# EAGLE design weather-cube_sensor_hdc1080_sht31d_ntc (EAGLE 7.7.0)
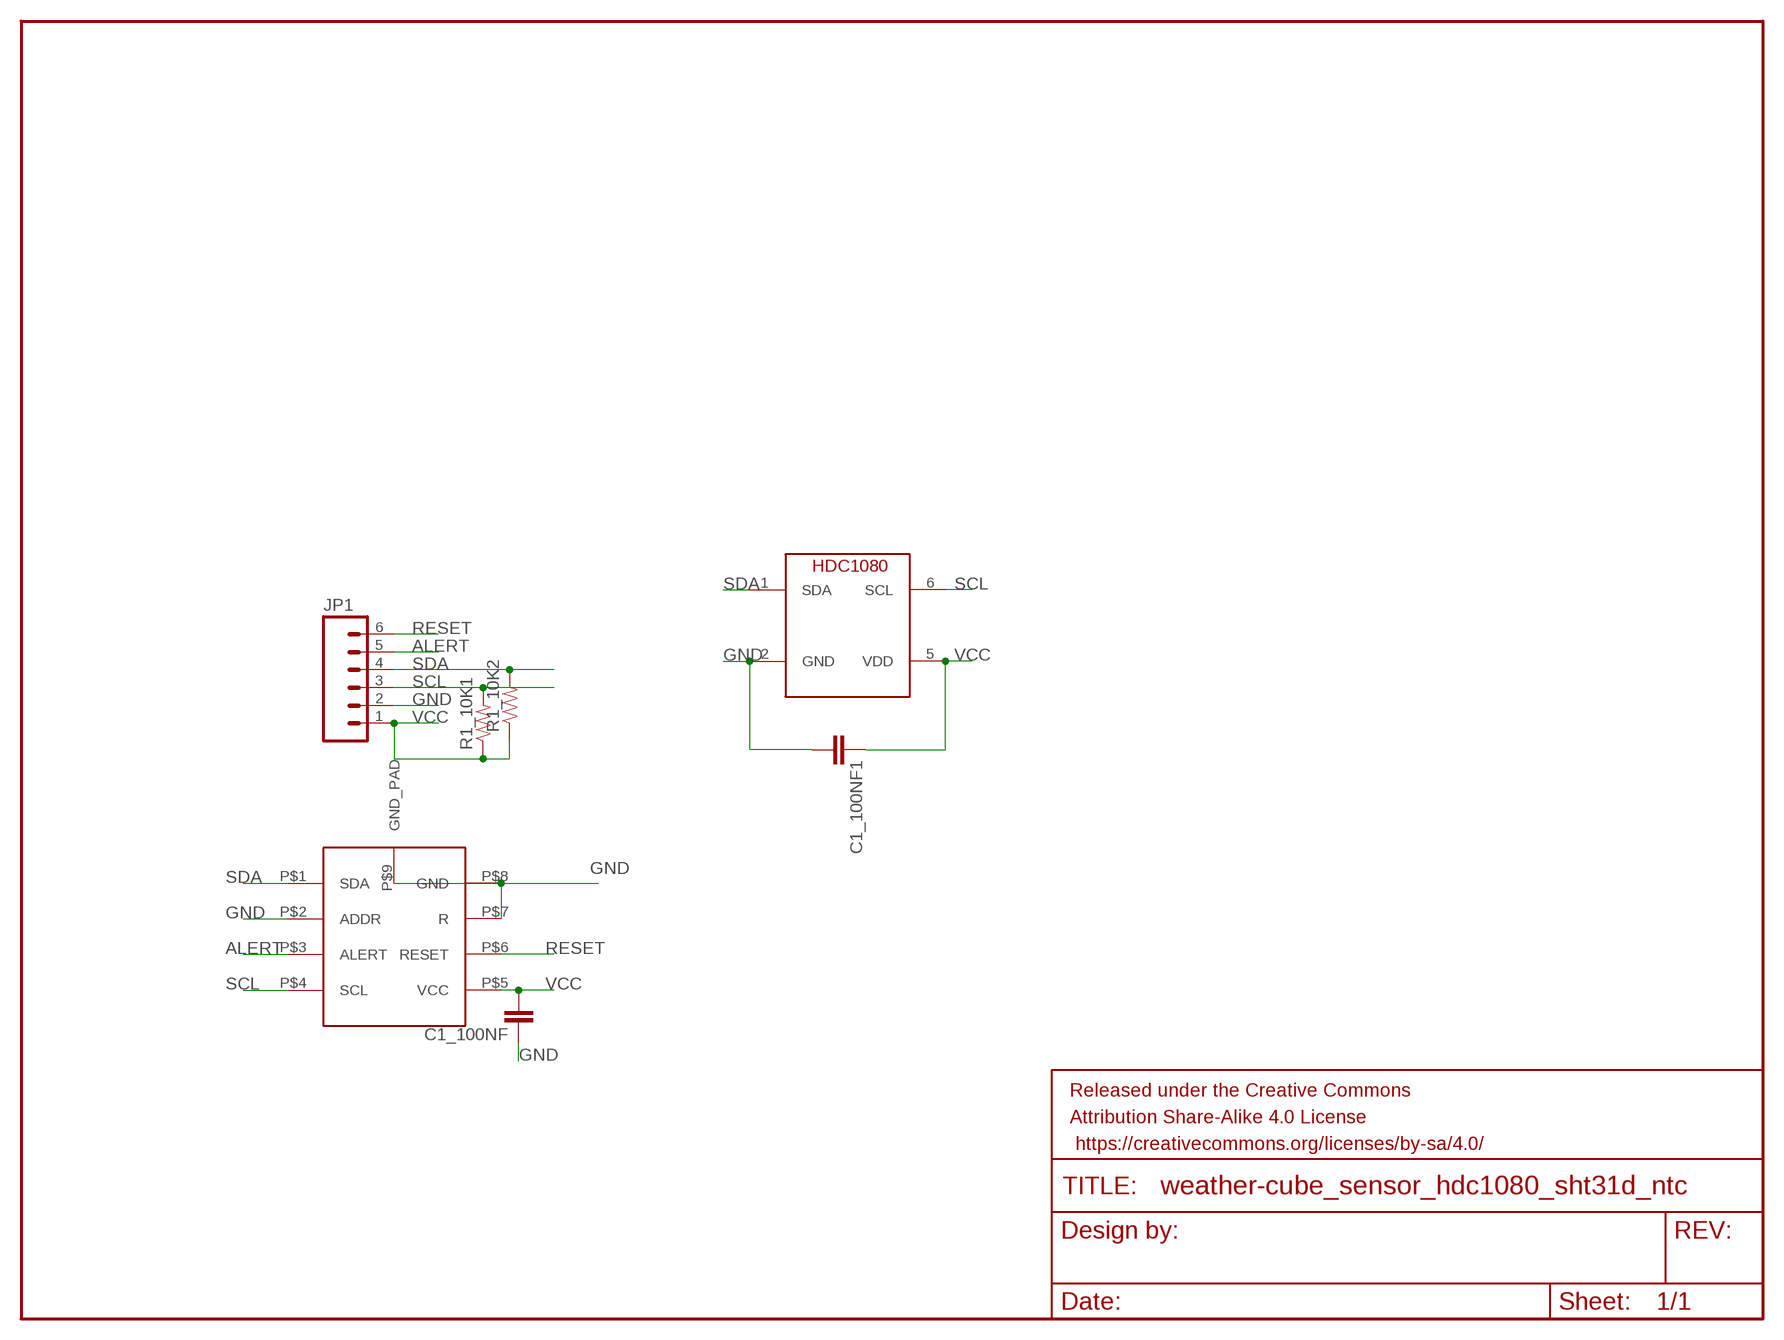
[diagram p0: schematic, sheet 1]

## Parts
C1_100NF  CAP0603-CAP  [0603-CAP]
C1_100NF1  CAP0603-CAP  [0603-CAP]
FRAME1  FRAME-LETTER  [CREATIVE_COMMONS]
JP1  M06SILK_FEMALE_PTH  [1X06]
R1_10K1  RESISTOR0603-RES  [0603-RES]
R1_10K2  RESISTOR0603-RES  [0603-RES]
U$1  SHT31-D  [SHT31-D]
U$2  HDC1080  [WSON-6-PAD]

## Nets
ALERT: JP1.5 U$1.P$3(ALERT)
GND: C1_100NF1.2 C1_100NF.1 JP1.2 U$1.P$2(ADDR) U$1.P$7(R) U$1.P$8(GND) U$1.P$9(GND_PAD) U$2.2(GND)
RESET: JP1.6 U$1.P$6(RESET)
SCL: JP1.3 R1_10K1.2 U$1.P$4(SCL) U$2.6(SCL)
SDA: JP1.4 R1_10K2.2 U$1.P$1(SDA) U$2.1(SDA)
VCC: C1_100NF1.1 C1_100NF.2 JP1.1 R1_10K1.1 R1_10K2.1 U$1.P$5(VCC) U$2.5(VDD)

## Library data of the parts
C1_100NF C1_100NF1 = SparkFun-Passives:CAP: Capacitor Standard 0603 ceramic capacitor, and 0.1" leaded capacitor.
FRAME1 = SparkFun-Aesthetics:FRAME-LETTER: Schematic Frame Standard 8.5x11 US Letter frame
JP1 = SparkFun-Connectors:M06: Header 6 Standard 6-pin 0.1" header. Use with straight break away headers (SKU : PRT-00116), right angle break away headers (PRT-00553), swiss pins (PRT-00743), machine pins (PRT-00117), and female headers (PRT-00115). Molex polarized connector foot print use with SKU : PRT-08094 with associated crimp pins and housings. NOTES ON THE VARIANTS LOCK and LOCK_LONGPADS... This footprint was designed to help hold the alignment of a through-hole component (i.e. 6-pin header) while soldering it into place. You may notice that each hole has been shifted either up or down by 0.005 of an inch from it's more standard position (which is a perfectly straight line). This slight alteration caused the pins (the squares in the middle) to touch the edges of the holes. Because they are alternating, it causes a "brace" to hold the component in place. 0.005 has proven to be the perfect amount of "off-center" position when using our standard breakaway headers. Although looks a little odd when you look at the bare footprint, once you have a header in there, the alteration is very hard to notice. Also,if you push a header all the way into place, it is covered up entirely on the bottom side. This idea of altering the position of holes to aid alignment will be further integrated into the Sparkfun Library for other footprints. It can help hold any component with 3 or more connection pins.; PROD_ID: CONN-08437
R1_10K1 R1_10K2 = SparkFun-Passives:RESISTOR: Resistor Basic schematic elements and footprints for 0603, 1206, and PTH resistors.
U$1 = awqua_eagle_library:SHT31-D
U$2 = WSON-6-PAD:HDC1080

## Board
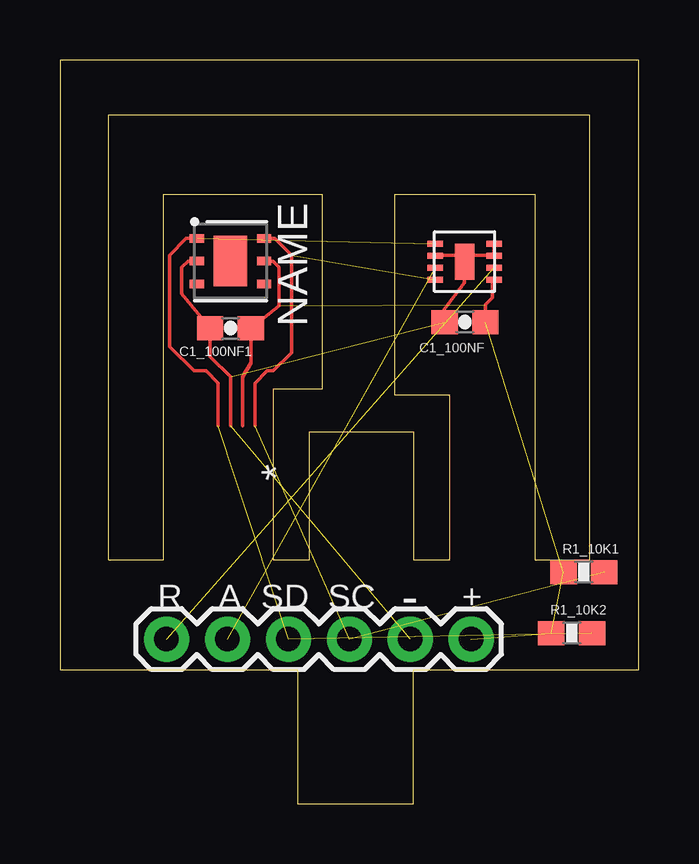
[diagram p1: board, top side]
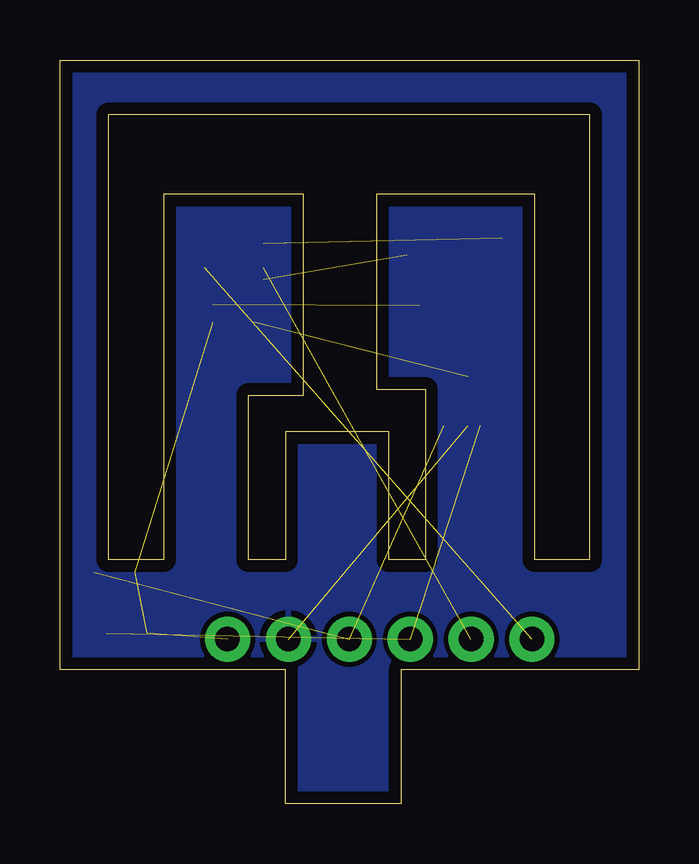
[diagram p2: board, bottom side, seen from below]

Size 24.13 x 30.99 mm. Coordinates in mm from the lower left corner, seen from the top.
Outline: 24.13,5.59 24.13,30.99 0,30.99 0,5.59 9.91,5.59 9.91,0 14.73,0 14.73,5.59 24.13,5.59
Outline: 2.03,10.16 2.03,28.7 22.1,28.7 22.1,10.16 19.81,10.16 19.81,25.4 13.97,25.4 13.97,17.02 16.26,17.02 16.26,10.16 14.73,10.16 14.73,15.49 10.41,15.49 10.41,10.16 8.89,10.16 8.89,17.27 10.92,17.27 10.92,25.4 4.32,25.4 4.32,10.16 2.03,10.16
Copper layers (1*16): Top 0.035mm / dielectric 1.5mm / Bottom 0.035mm
Design rules "default *": minimum track width 10mil, minimum drill 24mil, track to track 8mil, track to pad 8mil, pad to pad 8mil, via to via 8mil, smd to smd 8mil, copper to edge 20mil, drill to drill 8mil, minimum pad ring 10mil, minimum via ring 8mil, stop-mask expansion 4mil, vias tented up to drill 13mil, thermal gap 10mil

### Footprints (pad centres in the part's own frame; a part is rotated, then mirrored left to right if it is on the bottom)
0603-CAP = smd 1.1 x 1: 1 -0.85,0; 2 0.85,0
1X06 = drill 1.016 pad 1.88: 1 0,0; 2 2.54,0; 3 5.08,0; 4 7.62,0; 5 10.16,0; 6 12.7,0
0603-RES = smd 1.1 x 1: 1 -0.85,0; 2 0.85,0
SHT31-D = smd 0.65 x 0.25: P$1 0.025,2; P$2 0.025,1.5; P$3 0.025,1; P$4 0.025,0.5; P$5 2.475,0.5; P$6 2.475,1; P$7 2.475,1.5; P$8 2.475,2 | smd 0.8 x 1.5: P$9 1.25,1.25
WSON-6-PAD = smd 0.35 x 0.6: 1 -0.95,-1.4; 2 0,-1.4; 3 0.95,-1.4; 4 0.95,1.4; 5 0,1.4; 6 -0.95,1.4 | smd 2.1 x 1.4: PAD 0,0

### Placement (x,y rotation side)
C1_100NF  16.89,20.07 0 top
C1_100NF1  7.11,19.81 180 top
FRAME1  8.89,-21.08 0 top  (outside the outline)
JP1  17.14,6.86 180 top
R1_10K1  21.84,9.65 0 top
R1_10K2  21.34,7.11 0 top
U$1  15.62,21.34 0 top
U$2  7.11,22.61 270 top

### Tracks (layer width: path | path; a pad name or v marks a point on that pad's centre or on a via)
ALERT  (1 unrouted)
GND  (2 unrouted)
  Top 0.152: U$2.2 5.33,22.61 5.08,22.35 5.08,21.25 C1_100NF1.2 6.26,18.63 7.11,17.78 7.11,15.75 | U$1.P$9 16.87,22.71 17.02,22.86 18.07,22.86 U$1.P$7 U$1.P$8 | U$1.P$9 16.87,22.75 16.76,22.86 15.67,22.86 U$1.P$2 | U$1.P$9 16.87,21.7 16,20.57 16,20.36 C1_100NF.1
  pour Top: 34.29,1.65 32.89,27.81 45.85,19.81 46.23,12.95
  pour Bottom: -5.84,33.15 28.83,32.64 27.05,-3.05 -1.52,-2.29
RESET  (1 unrouted)
SCL  (3 unrouted)
  Top 0.152: U$2.6 8.96,23.56 9.65,22.86 9.65,18.8 8.89,18.03 8.64,18.03 8.13,17.53 8.13,15.75
SDA  (3 unrouted)
  Top 0.152: U$2.1 5.27,23.56 4.57,22.86 4.57,19.05 5.59,18.03 6.1,18.03 6.6,17.53 6.6,15.75
VCC  (4 unrouted)
  Top 0.152: U$2.5 8.89,22.61 9.14,22.35 9.14,20.74 C1_100NF1.1 7.96,18.38 7.62,17.78 7.62,15.75 | C1_100NF.2 17.74,20.79 18.03,21.08 18.03,21.77 U$1.P$5

### Text on the board
tPlace: * | R | A | SD | SC | - | +
tNames: Chris Kelley